# Altium project MD2084-R3M2E2.PrjPcb (part 2 of 3)

## Sheet BOOT_JTAG_AUX.SchDoc: =project_title
size Tabloid; CompanyName: Luxonis Holding; DrawnBy: Martin Debevc; Organization: Luxonis Holding; Address1: 1925 Harmony Park Drive; Address2: Westminster, CO; Address3: 80234; Address4: United States; DocumentNumber: D2088000; Revision: R3M2E2; SheetNumber: 3; SheetTotal: 13
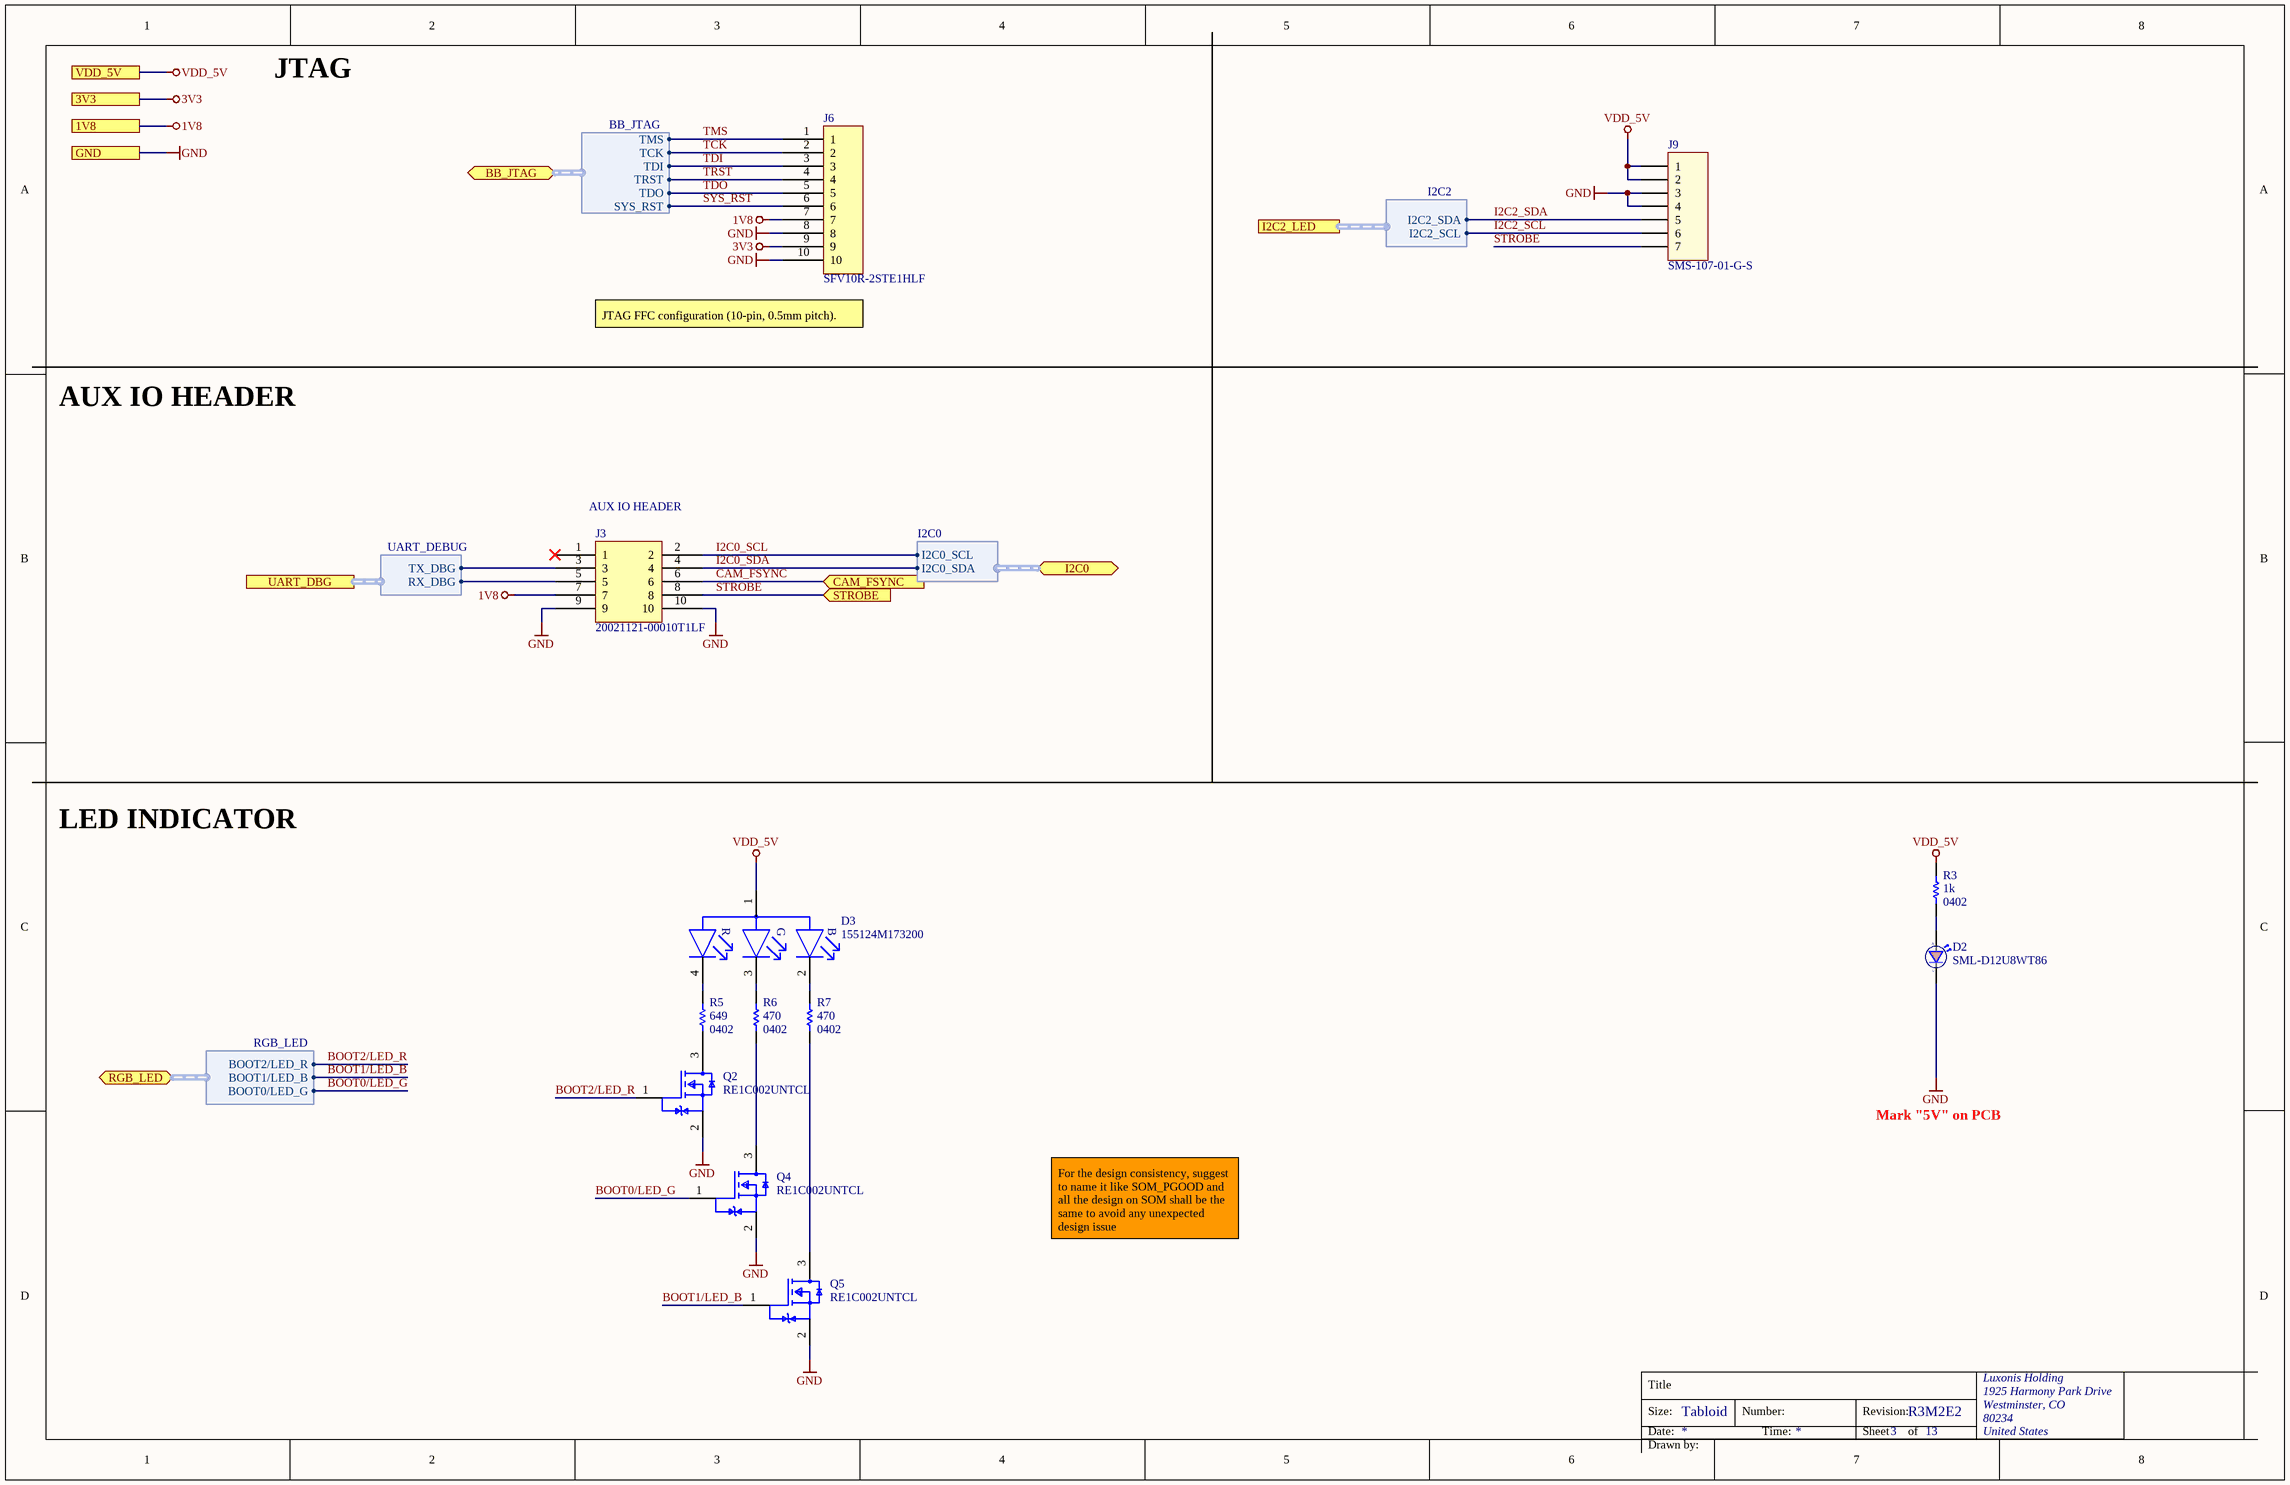
[diagram p7: BOOT_JTAG_AUX.SchDoc]

### Parts
D2  SML-D12U8WT86  [SML_D1xx8W]
D3  155124M173200  [FP-155124M173200-MFG]
J3  20021121-00010T1LF  [20021121-00010T1LF]
J6  SFV10R-2STE1HLF  [SFV10R-2STE1HLF]
J9  SMS-107-01-G-S  [SMS-107-01-G-S]
Q2  RE1C002UNTCL  [RE1C002UNTCL]
Q4  RE1C002UNTCL  [RE1C002UNTCL]
Q5  RE1C002UNTCL  [RE1C002UNTCL]
R3  value 1k  Case/Package: 0402  [RESC0402(1005)_L]  (hidden comment: RC0402FR-071KL)
R5  value 649  Case/Package: 0402  [RESC1005X40X25NL05T10]  (hidden comment: RC0402FR-07649RL)
R6  value 470  Case/Package: 0402  [RESC0402(1005)_L]  (hidden comment: CRCW0402470RFKED)
R7  value 470  Case/Package: 0402  [RESC0402(1005)_L]  (hidden comment: CRCW0402470RFKED)

### Ports
1V8, 3V3, BB_JTAG (bidir, harness BB_JTAG), CAM_FSYNC (in), GND, I2C0 (bidir, harness I2C0), I2C2_LED (harness I2C2), RGB_LED (bidir, harness RGB_LED), STROBE (in), UART_DBG (harness UART_DEBUG), VDD_5V

### Harnesses
BB_JTAG: TMS, TCK, TDI, TRST, TDO, SYS_RST
I2C0: I2C0_SDA, I2C0_SCL
RGB_LED: BOOT2/LED_R, BOOT1/LED_B, BOOT0/LED_G
UART_DEBUG: RX_DBG, TX_DBG
I2C2: I2C2_SDA, I2C2_SCL

### Nets
1V8: J3.7 J6.7 ; port 1V8
3V3: J6.9 ; port 3V3
GND: D2.1(C) J3.9 J3.10 J6.8 J6.10 J9.3 J9.4 Q2.2(Source) Q4.2(Source) Q5.2(Source) ; port GND
VDD_5V: D3.1(COMMON_ANODE) J9.1 J9.2 R3.2 ; port VDD_5V
BOOT0/LED_G: Q4.1(Gate) ; port RGB_LED.BOOT0/LED_G
BOOT1/LED_B: Q5.1(Gate) ; port RGB_LED.BOOT1/LED_B
BOOT2/LED_R: Q2.1(Gate) ; port RGB_LED.BOOT2/LED_R
CAM_FSYNC: J3.6 ; port CAM_FSYNC
I2C0_SCL: J3.2 ; port I2C0.I2C0_SCL
I2C0_SDA: J3.4 ; port I2C0.I2C0_SDA
I2C2_SCL: J9.6 ; port I2C2_LED.I2C2_SCL
I2C2_SDA: J9.5 ; port I2C2_LED.I2C2_SDA
RX_DBG: J3.3 ; port UART_DBG.TX_DBG
STROBE: J3.8 J9.7 ; port STROBE
SYS_RST: J6.6 ; port BB_JTAG.SYS_RST
TCK: J6.2 ; port BB_JTAG.TCK
TDI: J6.3 ; port BB_JTAG.TDI
TDO: J6.5 ; port BB_JTAG.TDO
TMS: J6.1 ; port BB_JTAG.TMS
TRST: J6.4 ; port BB_JTAG.TRST
TX_DBG: J3.5 ; port UART_DBG.RX_DBG
NetD2_2: D2.2(A) R3.1
NetD3_2: D3.2(BLUE_C) R7.2
NetD3_3: D3.3(GREEN_C) R6.2
NetD3_4: D3.4(RED_C) R5.2
NetQ2_3: Q2.3(Drain) R5.1
NetQ4_3: Q4.3(Drain) R6.1
NetQ5_3: Q5.3(Drain) R7.1

Not connected (* = marked no-connect by the designer): J3 1*

### Notes on the sheet
- JTAG
- (near J6) JTAG FFC configuration (10-pin, 0.5mm pitch).
- AUX IO HEADER
- (near J3) AUX IO HEADER
- LED INDICATOR
- Mark "5V" on PCB
- For the design consistency, suggest to name it like SOM_PGOOD and all the design on SOM shall be the same to avoid any unexpected design issue
- Title
- Size:
- Date:
- Tabloid
- Number:
- Time:
- Revision:
- Sheet
- of
- Drawn by:
- (in symbol CMP-007-00038-4) R; G; B

### Library data of the parts
D2 = CMP-111-000005-2: LED RED DIFFUSED 0603 SMD Red 620nm LED Indication - Discrete 2.2V 0603 (1608 Metric); Manufacturer 1: Rohm; Forward Current: 20mA; Manufacturer Part Number 1: SML-D12U8WT86; Case/Package: 0603; Forward Voltage: 2.2V; Min Operating Temperature: -40°C; Color: Red; Max Operating Temperature: 85°C
D3 = CMP-007-00038-4: Triple Color LED; Manufacturer 1: Wurth Elektronik; Max Current Rating: 30mA; Viewing Angle: 120°; Colour: RGB; Forward Current: 20mA; Case/Package: 1204; Manufacturer Part Number 1: 155124M173200
J3 = CMP-005-000031-2: CONN HEADER SMD 10POS 1.27MM; Manufacturer 1: Amphenol FCI; Number of Contacts: 10; Contact Resistance: 30mR; Max Voltage Rating (AC): 125V; Connector Type: Male Pin; Row Spacing: 0.05inch; Manufacturer Part Number 1: 20021121-00010T1LF; Stock 1: 1465; Pricing 1: 1=0.77000, 10=0.71800, 100=0.55040, 500=0.47860, 1000=0.39485, 5000=0.34699, 10000=0.32306 (USD); RoHS: Yes; Mount: Surface Mount; Contact Plating: Gold; Color: Black; Contact Material: Copper Alloy; Housing Color: Black; Housing Material: Thermoplastic; Min Operating Temperature: -40°C; Max Operating Temperature: 85°C; Number of Rows: 2; Termination: Solder; Package Quantity: 93; Packaging: Rail/Tube; Number of Positions: 10; Orientation: Straight; Length: 6.35mm; Pitch: 1.27mm; Contact Mating Length: 0.12inch; Depth: 3.4mm; ComponentLink1URL: https://datasheet.ciiva.com/18659/20021121-18659066.pdf?src-supplier=Digi-Key; ComponentLink1Description: https://datasheet.ciiva.com/18659/20021121-18659066.pdf?src-supplier=Digi-Key; ComponentLink2URL: https://datasheet.ciiva.com/10033/20021121-10033582.pdf?src-supplier=Avnet; ComponentLink2Description: https://datasheet.ciiva.com/10033/20021121-10033582.pdf?src-supplier=Avnet; Design Item ID: 20021121-00010T1LF; Pins: 10; Source: LuxonisMaster.SchLib
J6 = CMP-005-000024-3: CONN FFC TOP 10POS 0.50MM R/A; Manufacturer 1: Amphenol FCI; Pitch: 0.5mm; Voltage Rating: 50V; Gender: Female; Orientation: Right Angle; Max Operating Temperature: 105°C; Min Operating Temperature: -55°C; Mount: Surface Mount; Manufacturer Part Number 1: SFV10R-2STE1HLF; Pins: 10
J9 = CMP-00063-2: Board Connector, 7 Contact(s), 1 Row(s), Female, Straight, 0.05 inch Pitch, Solder Terminal, Black Insulator, Socket; Manufacturer Series: SMS; DIN Conformance: No; Body Length: 0.35inch; Mating Information: MULTIPLE MATING PARTS AVAILABLE; Number Of Connectors: 1; Rated Current (Signal): 1A; Additional Feature: TIGER BUY CONTACT; Reliability: COMMERCIAL; Option: General Purpose; Contact Style: SQ PIN-SKT; Contact Resistance: 10mR; Body Depth: 0.18inch; Insertion Force-Max: 2.224N; Reference Standard: UL; Plating Thickness: 30uin; Contact Pattern: RECTANGULAR; Number of Contacts: 7; Body Breadth: 0.1inch; Withdrawl Force-Min: 1.668N; Contact Gender: Female; Mixed Contacts: No; Manufacturer Part Number 1: SMS-107-01-G-S; Pins: 7; MIL Conformance: No; IEC Conformance: No; System: connector; Contact Finish - Termination: Tin (Sn) - with Nickel (Ni) barrier; Number of Rows Loaded: 1; JESD-609 Code: e3; Body/Shell Style: SOCKET; Terminal Length: 0.115inch; Mounting Technology: Board; Min Operating Temperature: -65°C; RoHS Compliant: Yes; Insulation Color: Black; Termination: Solder; Terminal Pitch: 1.27mm; Insulation Material: Glass; Max Operating Temperature: 125°C; Mating Contact Pitch: 0.05inch; Reach SVHC Compliant: Yes; Connector Type: BOARD CONNECTOR; Number Of PCB Rows: 1; PCB Contact Pattern: RECTANGULAR; Contact Finish - Mating: GOLD (30) OVER NICKEL (50); Contact Material: Bronze; Mounting Style: STRAIGHT; Filter Feature: No
Q2 Q4 Q5 = CMP-120-000001-2: MOSFET N-CH 20V 0.2A EMT3; Manufacturer 1: Rohm; Continuous Drain Current: 200mA; Case/Package: SOT-89; Manufacturer Part Number 1: RE1C002UNTCL; Design Item ID: RE1C002UNTCL; Max Drain to Source Voltage: 20V
R3 = CMP-013-000004-10: RES SMD 1K OHM 1% 1/16W 0402; Manufacturer 1: Yageo; Power Rating: 62.5mW; Voltage Rating: 50V; Min Operating Temperature: -55°C; Design Item ID: RC0402FR-071KL; Tolerance: 1%; Max Operating Temperature: 155°C; Manufacturer Part Number 1: RC0402FR-071KL
R5 = CMP-009-00231-10: RES SMD 649 OHM 1% 1/16W 0402; Manufacturer 1: YAGEO; Voltage Rating: 50V; Manufacturer Part Number 1: RC0402FR-07649RL; Tolerance: 1%
R6 = CMP-013-000029-9: RES SMD 470 OHM 1% 1/16W 0402; Manufacturer 1: Vishay; Voltage Rating: 50V; Power Rating: 63mW; Max Operating Temperature: 155°C; Min Operating Temperature: -55°C; Manufacturer Part Number 1: CRCW0402470RFKED; Tolerance: 1%; Design Item ID: CRCW0402470RFKED
R7 = CMP-013-000029-9: RES SMD 470 OHM 1% 1/16W 0402; Manufacturer 1: Vishay; Power Rating: 63mW; Voltage Rating: 50V; Min Operating Temperature: -55°C; Max Operating Temperature: 155°C; Tolerance: 1%; Manufacturer Part Number 1: CRCW0402470RFKED; Design Item ID: CRCW0402470RFKED

## Sheet POWER_GEN.SchDoc: =project_title
size Tabloid; CompanyName: Luxonis Holding; DrawnBy: Martin Debevc; Organization: Luxonis Holding; Address1: 1925 Harmony Park Drive; Address2: Westminster, CO; Address3: 80234; Address4: United States; DocumentNumber: D2088000; Revision: R3M2E2; SheetNumber: 11; SheetTotal: 13
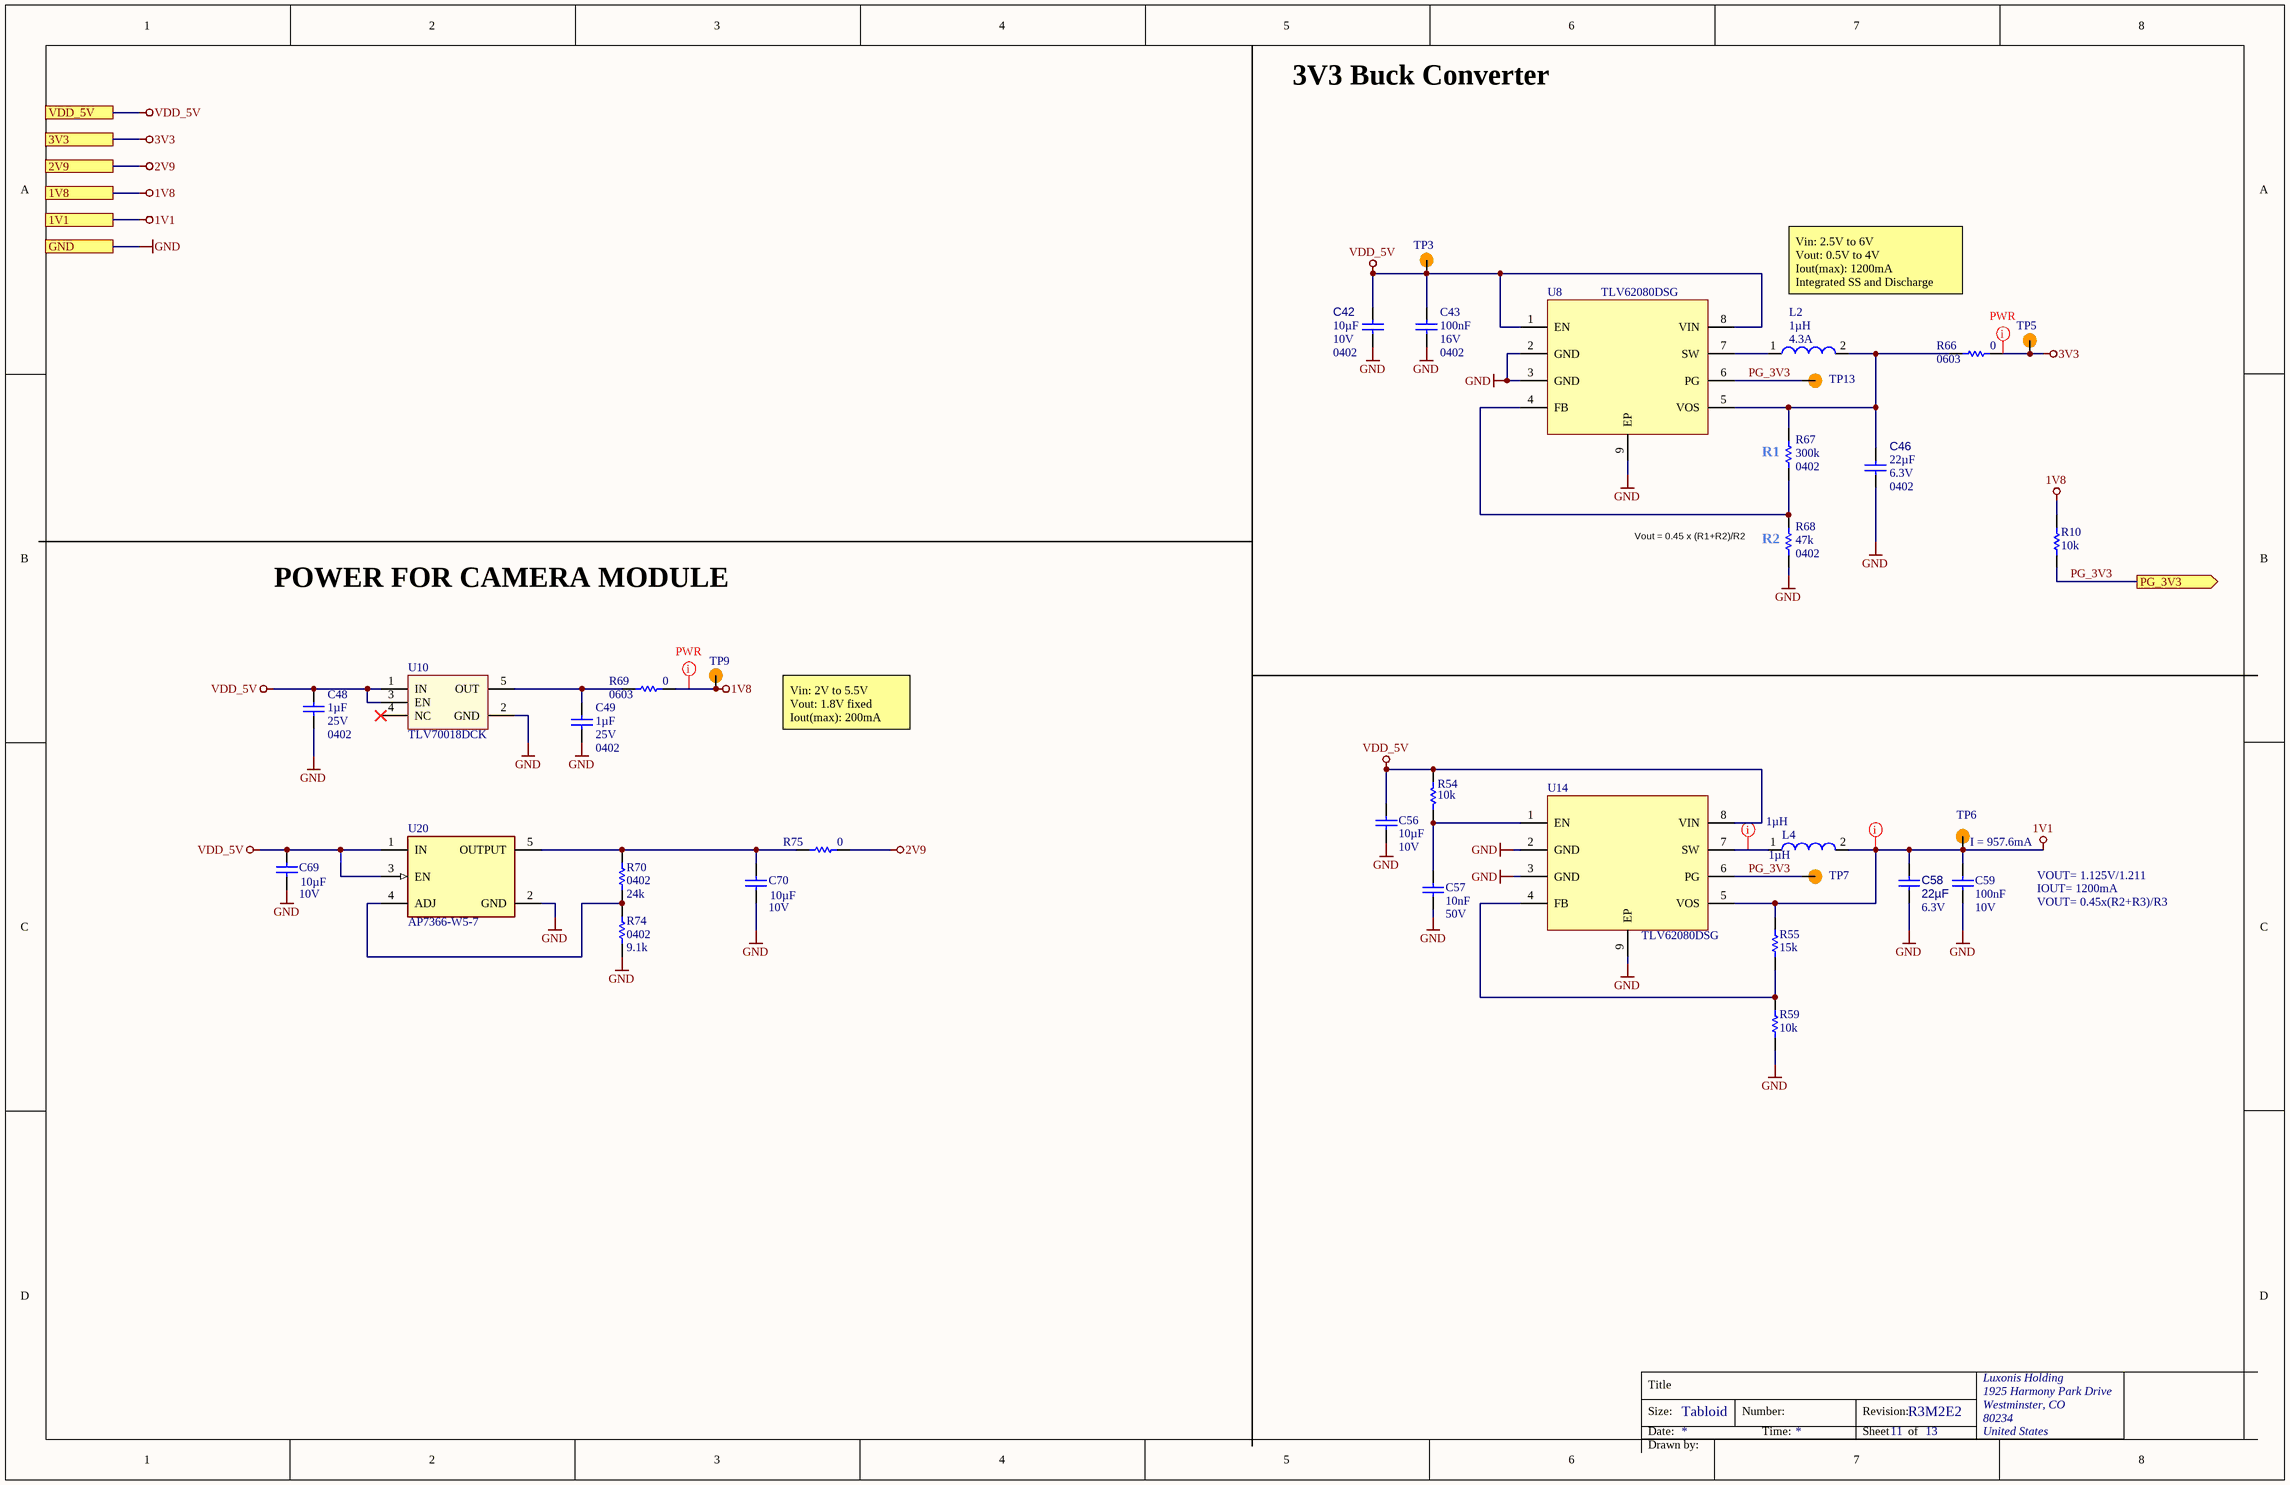
[diagram p8: POWER_GEN.SchDoc]

### Parts
C42  value 10µF  Voltage Rating: 10V  Case/Package: 0402  [CAPC0402(1005)60_L]  (hidden comment: GRM155R61A106ME11D)
C43  value 100nF  Voltage Rating: 16V  Case/Package: 0402  [CAPC0402(1005)60_N]  (hidden comment: CL05B104KO5NFNC)
C46  value 22µF  Voltage Rating: 6.3V  Case/Package: 0402  [CAPC0402(1005)60_L]  (hidden comment: CL05A226MQ5N6J8)
C48  value 1µF  Voltage Rating: 25V  Case/Package: 0402  [CAPC0402(1005)70_N]  (hidden comment: GRM155R61E105KA12D)
C49  value 1µF  Voltage Rating: 25V  Case/Package: 0402  [CAPC0402(1005)70_N]  (hidden comment: GRM155R61E105KA12D)
C56  10µF  Voltage Rating: 10V  [CAPC0603(1608)100_L]
C57  10nF  Voltage Rating: 50V  [CAPC0402(1005)60_L]
C58  22µF  Voltage Rating: 6.3V  [CAPC0402(1005)60_L]
C59  100nF  Voltage Rating: 10V  [CAPC0402(1005)70_L]
C69  value 10µF  Voltage Rating: 10V  [CAPC0603(1608)100_L]  (hidden comment: GRM188R61A106ME69D)
C70  value 10µF  Voltage Rating: 10V  [CAPC0603(1608)100_L]  (hidden comment: GRM188R61A106ME69D)
L2  value 1µH  Current Rating: 4.3A  [DFE252012P-1R0M=P2]  (hidden comment: DFE252012P-1R0M=P2)
L4  1µH  [DFE252012P-1R0M=P2]
R10  10k  [RESC0402(1005)_L]
R54  10k  [RESC0402(1005)_L]
R55  15k  [RESC0402(1005)_L]
R59  10k  [RESC0402(1005)_L]
R66  value 0  Case/Package: 0603  [RESC0603(1608)_N]  (hidden comment: CRCW06030000Z0EA)
R67  value 300k  Case/Package: 0402  [RESC0402(1005)_N]  (hidden comment: RC0402FR-07300KL)
R68  value 47k  Case/Package: 0402  [RESC0402(1005)_L]  (hidden comment: RC0402FR-0747KL)
R69  value 0  Case/Package: 0603  [RESC0603(1608)_N]  (hidden comment: CRCW06030000Z0EA)
R70  value 24k  Case/Package: 0402  [RESC0402(1005)_L]  (hidden comment: RC0402FR-0724KL)
R74  value 9.1k  Case/Package: 0402  [RESC0402(1005)_L]  (hidden comment: CRCW04029K10FKED)
R75  value 0  [RESC0603(1608)_N]  (hidden comment: CRCW06030000Z0EA)
TP3  TEST_POINT  [TP075_150_NS]  (value not drawn)  (no BOM)
TP5  TEST_POINT  [TP075_150_NS]  (value not drawn)  (no BOM)
TP6  TEST_POINT  [TP075_150_NS]  (value not drawn)  (no BOM)
TP7  TEST_POINT  [TP075_150_NS]  (value not drawn)  (no BOM)
TP9  TEST_POINT  [TP075_150_NS]  (value not drawn)  (no BOM)
TP13  TEST_POINT  [TP075_150_NS]  (value not drawn)  (no BOM)
U8  TLV62080DSG  [TLV62080DSG]
U10  TLV70018DCK  [TLV70018DCK]
U14  TLV62080DSG  [TLV62080DSG]
U20  AP7366-W5-7  [FP-SOT25-MFG]

### Ports
1V1, 1V8, 2V9, 3V3, GND, PG_3V3 (out), VDD_5V

### Nets
1V1: C58.2 C59.2 L4.2 R55.2 TP6.1 U14.5(VOS) ; port 1V1
1V8: R10.2 R69.2 TP9.1 ; port 1V8
2V9: R75.2 ; port 2V9
3V3: R66.2 TP5.1 ; port 3V3
GND: C42.1 C43.1 C46.1 C48.1 C49.1 C56.1 C57.1 C58.1 C59.1 C69.1 C70.1 R59.1 R68.1 R74.1 U8.2(GND) U8.3(GND) U8.9(EP) U10.2(GND) U14.2(GND) U14.3(GND) U14.9(EP) U20.2(GND) ; port GND
VDD_5V: C42.2 C43.2 C48.2 C56.2 C69.2 R54.2 TP3.1 U8.1(EN) U8.8(VIN) U10.1(IN) U10.3(EN) U14.8(VIN) U20.1(IN) U20.3(EN) ; port VDD_5V
PG_3V3: R10.1 TP7.1 TP13.1 U8.6(PG) U14.6(PG) ; port PG_3V3
NetC46_2: C46.2 L2.2 R66.1 R67.2 U8.5(VOS)
NetC49_2: C49.2 R69.1 U10.5(OUT)
NetC57_2: C57.2 R54.1 U14.1(EN)
NetC70_2: C70.2 R70.2 R75.1 U20.5(OUTPUT)
NetL2_1: L2.1 U8.7(SW)
NetL4_1: L4.1 U14.7(SW)
NetR55_1: R55.1 R59.2 U14.4(FB)
NetR67_1: R67.1 R68.2 U8.4(FB)
NetR70_1: R70.1 R74.2 U20.4(ADJ)

Not connected (* = marked no-connect by the designer): U10 4(NC)*

### Layout directives
net class PWR; Current Rating: 1200mA: 3V3
net class Power_trace: 1V1, NetL4_1
net class PWR; Current Rating: 300mA: 1V8

### Notes on the sheet
- 3V3 Buck Converter
- Vin: 2.5V to 6V
  Vout: 0.5V to 4V
  Iout(max): 1200mA
  Integrated SS and Discharge
- (near R67) R1
- (near R68) Vout = 0.45 x (R1+R2)/R2
- (near R68) R2
- POWER FOR CAMERA MODULE
- Vin: 2V to 5.5V
  Vout: 1.8V fixed
  Iout(max): 200mA
- (near TP6) I = 957.6mA
- VOUT= 1.125V/1.211
- IOUT= 1200mA
- VOUT= 0.45x(R2+R3)/R3
- Title
- Size:
- Date:
- Tabloid
- Number:
- Time:
- Revision:
- Sheet
- of
- Drawn by:

### Library data of the parts
C42 = CMP-001-00125-4: CAP CER 10UF 10V X5R 0402 20%; Manufacturer 1: Murata; Mounting Technology: SMT; Tolerance: 20%; Manufacturer Part Number 1: GRM155R61A106ME11D; Dielectric: X5R
C43 = CMP-108-000002-6: as C38 on sheet CONNECTOR_A; ComponentLink1URL: https://datasheet.ciiva.com/25767/cl05b104ko5nfnc-25767124.pdf?src-supplier=Digi-Key; Length: 1mm; Design Item ID: CL05B104KO5NFNC; Tolerance: 10%; Min Operating Temperature: -55°C; Width: 0.02inch; Dielectric: X7R; ComponentLink1Description: https://datasheet.ciiva.com/25767/cl05b104ko5nfnc-25767124.pdf?src-supplier=Digi-Key; Height: 0.5mm; Depth: 0.5mm; Manufacturer Part Number 1: CL05B104KO5NFNC; Max Operating Temperature: 125°C; Mounting Technology: SMT
C46 = CMP-001-00163-4: CAP CER 22UF 6.3V X5R 0402 20%; Manufacturer 1: Samsung; Manufacturer Part Number 1: CL05A226MQ5N6J8; Mounting Technology: Surface Mount; Tolerance: 20%
C48 C49 = CMP-108-000014-5: as C17 on sheet ETH_PCIE_CTRL; ComponentLink2Description: https://datasheet.ciiva.com/7719/1666664-7719006.pdf?src-supplier=Element14; ComponentLink2URL: https://datasheet.ciiva.com/7719/1666664-7719006.pdf?src-supplier=Element14; Max Operating Temperature: 85°C; Depth: 0.5mm; Mounting Technology: SMT; ComponentLink1URL: https://datasheet.ciiva.com/22732/1666664-22732122.pdf?src-supplier=Element14; Length: 1mm; ComponentLink1Description: https://datasheet.ciiva.com/22732/1666664-22732122.pdf?src-supplier=Element14; Manufacturer Part Number 1: GRM155R61E105KA12D; Tolerance: 10%; Design Item ID: GRM155R61E105KA12D; Dielectric: X5R; Min Operating Temperature: -55°C; Height: 0.5mm; Width: 0.5mm
C56 = CMP-004-000018-4: CAP CER 10UF 10V X5R 0603 20%; Manufacturer 1: Murata; Manufacturer Part Number 1: GRM188R61A106ME69D; Case/Package: 0603; Min Operating Temperature: -55°C; Max Operating Temperature: 85°C; Tolerance: 20%; Dielectric: X5R; Length: 1.6mm; Height: 0.8mm; Width: 0.8mm; Depth: 0.8mm; ComponentLink1URL: http://www.mouser.com/ds/2/281/c02e-2905.pdf?src-supplier=Mouser; ComponentLink1Description: http://www.mouser.com/ds/2/281/c02e-2905.pdf?src-supplier=Mouser; ComponentLink2URL: http://components.arrow.com/part/dataview/0323_06119472?src-supplier=Arrow+Europe; ComponentLink2Description: http://components.arrow.com/part/dataview/0323_06119472?src-supplier=Arrow+Europe; ComponentLink3URL: http://www.farnell.com/datasheets/2048014.pdf?src-supplier=Farnell; ComponentLink3Description: http://www.farnell.com/datasheets/2048014.pdf?src-supplier=Farnell; ComponentLink4URL: http://www.farnell.com/datasheets/1872210.pdf?src-supplier=Farnell; ComponentLink4Description: http://www.farnell.com/datasheets/1872210.pdf?src-supplier=Farnell; ComponentLink5URL: http://search.murata.co.jp/Ceramy/image/img/A01X/G101/ENG/GRM188R61A106ME69-01.pdf?src-supplier=Digi-Key; ComponentLink5Description: http://search.murata.co.jp/Ceramy/image/img/A01X/G101/ENG/GRM188R61A106ME69-01.pdf?src-supplier=Digi-Key; ComponentLink6URL: http://www.farnell.com/datasheets/1872210.pdf?src-supplier=Newark; ComponentLink6Description: http://www.farnell.com/datasheets/1872210.pdf?src-supplier=Newark; ComponentLink7URL: http://www.farnell.com/datasheets/2048014.pdf?src-supplier=Element14; ComponentLink7Description: http://www.farnell.com/datasheets/2048014.pdf?src-supplier=Element14; ComponentLink8URL: http://www.farnell.com/datasheets/2048014.pdf?src-supplier=Newark; ComponentLink8Description: http://www.farnell.com/datasheets/2048014.pdf?src-supplier=Newark; Design Item ID: GRM188R61A106ME69D; Mounting Technology: SMT; Value: 10µF
C57 = CMP-108-000016-6: CAP CER 10000PF 50V X7R 0402 10%; Manufacturer 1: Murata; Manufacturer Part Number 1: GRM155R71H103KA88D; Case/Package: 0402; Min Operating Temperature: -55°C; Max Operating Temperature: 125°C; Tolerance: 10%; Dielectric: X7R; Length: 1mm; Height: 0.5mm; Width: 0.02inch; Depth: 0.5mm; ComponentLink1URL: https://datasheet.ciiva.com/129/product-129810.pdf?src-supplier=Digi-Key; ComponentLink1Description: https://datasheet.ciiva.com/129/product-129810.pdf?src-supplier=Digi-Key; ComponentLink2URL: https://datasheet.ciiva.com/19476/1856433-19476546.pdf?src-supplier=Jameco; ComponentLink2Description: https://datasheet.ciiva.com/19476/1856433-19476546.pdf?src-supplier=Jameco; ComponentLink3URL: https://datasheet.ciiva.com/11786/0900766b80ef921d-11786340.pdf?src-supplier=RSComponents; ComponentLink3Description: https://datasheet.ciiva.com/11786/0900766b80ef921d-11786340.pdf?src-supplier=RSComponents; ComponentLink4URL: https://datasheet.ciiva.com/18100/getdatasheetpartid-27434-18100660.pdf?src-supplier=Verical; ComponentLink4Description: https://datasheet.ciiva.com/18100/getdatasheetpartid-27434-18100660.pdf?src-supplier=Verical; ComponentLink5URL: https://datasheet.ciiva.com/22698/1747449-22698420.pdf?src-supplier=Element14; ComponentLink5Description: https://datasheet.ciiva.com/22698/1747449-22698420.pdf?src-supplier=Element14; ComponentLink6URL: https://datasheet.ciiva.com/29199/454225-da-01-en-vs-kondensator-0402-29199740.pdf?src-supplier=Conrad; ComponentLink6Description: https://datasheet.ciiva.com/29199/454225-da-01-en-vs-kondensator-0402-29199740.pdf?src-supplier=Conrad; ComponentLink7URL: https://datasheet.ciiva.com/129/grm155r71h103ka88-01-129811.pdf?src-supplier=Digi-Key; ComponentLink7Description: https://datasheet.ciiva.com/129/grm155r71h103ka88-01-129811.pdf?src-supplier=Digi-Key; ComponentLink8URL: https://datasheet.ciiva.com/129/grm155r71h103ka88-01-129812.pdf?src-supplier=Digi-Key; ComponentLink8Description: https://datasheet.ciiva.com/129/grm155r71h103ka88-01-129812.pdf?src-supplier=Digi-Key; ComponentLink9URL: https://datasheet.ciiva.com/16495/product-16495290.pdf?src-supplier=Future+Electronics; ComponentLink9Description: https://datasheet.ciiva.com/16495/product-16495290.pdf?src-supplier=Future+Electronics; ComponentLink10URL: https://datasheet.ciiva.com/5410/product-5410990.pdf?src-supplier=Mouser; ComponentLink10Description: https://datasheet.ciiva.com/5410/product-5410990.pdf?src-supplier=Mouser; Design Item ID: GRM155R71H103KA88D; Mounting Technology: SMT; Value: 10nF
C58 = CMP-001-00163-4: CAP CER 22UF 6.3V X5R 0402 20%; Manufacturer 1: Samsung; Manufacturer Part Number 1: CL05A226MQ5N6J8; Case/Package: 0402; Tolerance: 20%; Mounting Technology: Surface Mount; Value: 22µF
C59 = CMP-108-000015-5: CAP CER 0.1UF 10V X7R 0402 5%; Manufacturer 1: Murata; Manufacturer Part Number 1: GRM155R71A104JA01D; Case/Package: 0402; Min Operating Temperature: -55°C; Max Operating Temperature: 125°C; Tolerance: 5%; Dielectric: X7R; Length: 1mm; Height: 0.5mm; Width: 0.02inch; Depth: 0.5mm; ComponentLink1URL: https://datasheet.ciiva.com/5411/product-5411135.pdf?src-supplier=Mouser; ComponentLink1Description: https://datasheet.ciiva.com/5411/product-5411135.pdf?src-supplier=Mouser; ComponentLink2URL: https://datasheet.ciiva.com/11618/c02e-11618821.pdf?src-supplier=Avnet; ComponentLink2Description: https://datasheet.ciiva.com/11618/c02e-11618821.pdf?src-supplier=Avnet; Design Item ID: GRM155R71A104JA01D; Mounting Technology: SMT; Value: 100nF
C69 C70 = CMP-004-000018-4: CAP CER 10UF 10V X5R 0603 20%; Manufacturer 1: Murata; Manufacturer Part Number 1: GRM188R61A106ME69D; Case/Package: 0603; Min Operating Temperature: -55°C; Max Operating Temperature: 85°C; Tolerance: 20%; Dielectric: X5R; Length: 1.6mm; Height: 0.8mm; Width: 0.8mm; Depth: 0.8mm; ComponentLink1URL: http://www.mouser.com/ds/2/281/c02e-2905.pdf?src-supplier=Mouser; ComponentLink1Description: http://www.mouser.com/ds/2/281/c02e-2905.pdf?src-supplier=Mouser; ComponentLink2URL: http://components.arrow.com/part/dataview/0323_06119472?src-supplier=Arrow+Europe; ComponentLink2Description: http://components.arrow.com/part/dataview/0323_06119472?src-supplier=Arrow+Europe; ComponentLink3URL: http://www.farnell.com/datasheets/2048014.pdf?src-supplier=Farnell; ComponentLink3Description: http://www.farnell.com/datasheets/2048014.pdf?src-supplier=Farnell; ComponentLink4URL: http://www.farnell.com/datasheets/1872210.pdf?src-supplier=Farnell; ComponentLink4Description: http://www.farnell.com/datasheets/1872210.pdf?src-supplier=Farnell; ComponentLink5URL: http://search.murata.co.jp/Ceramy/image/img/A01X/G101/ENG/GRM188R61A106ME69-01.pdf?src-supplier=Digi-Key; ComponentLink5Description: http://search.murata.co.jp/Ceramy/image/img/A01X/G101/ENG/GRM188R61A106ME69-01.pdf?src-supplier=Digi-Key; ComponentLink6URL: http://www.farnell.com/datasheets/1872210.pdf?src-supplier=Newark; ComponentLink6Description: http://www.farnell.com/datasheets/1872210.pdf?src-supplier=Newark; ComponentLink7URL: http://www.farnell.com/datasheets/2048014.pdf?src-supplier=Element14; ComponentLink7Description: http://www.farnell.com/datasheets/2048014.pdf?src-supplier=Element14; ComponentLink8URL: http://www.farnell.com/datasheets/2048014.pdf?src-supplier=Newark; ComponentLink8Description: http://www.farnell.com/datasheets/2048014.pdf?src-supplier=Newark; Design Item ID: GRM188R61A106ME69D; Mounting Technology: SMT
L2 = CMP-082-000001-2: FIXED IND 1UH 3.2A 42 MOHM SMD; Manufacturer: Murata; Tolerance: 20%; Manufacturer Part Number: DFE252012P-1R0M=P2; Case/Package: 1008; Manufacturer 1: Murata; Manufacturer Part Number 1: DFE252012P-1R0M=P2; Manufacturer 2: Murata; Manufacturer Part Number 2: DFE252012P-1R0M=P2; Manufacturer 3: Murata; Manufacturer Part Number 3: DFE252012P-1R0M=P2; Manufacturer 4: Murata; Manufacturer Part Number 4: DFE252012P-1R0M=P2
L4 = CMP-082-000001-2: FIXED IND 1UH 3.2A 42 MOHM SMD; Manufacturer 1: Murata; Current Rating: 4.3A; Tolerance: 20%; Case/Package: 1008; Manufacturer Part Number 1: DFE252012P-1R0M=P2; Manufacturer 2: Murata; Manufacturer Part Number 2: DFE252012P-1R0M=P2; Manufacturer 3: Murata; Manufacturer Part Number 3: DFE252012P-1R0M=P2; Manufacturer 4: Murata; Manufacturer Part Number 4: DFE252012P-1R0M=P2; Manufacturer: Murata; Manufacturer Part Number: DFE252012P-1R0M=P2; Value: 1µH
R10 R54 R59 = CMP-115-000004-8: RES SMD 10K OHM 1% 1/16W 0402; Manufacturer 1: Yageo; Manufacturer Part Number 1: RC0402FR-1310KL; Temperature Coefficient: 100ppm/°C; Power Rating: 62.5mW; Voltage Rating: 50V; Case/Package: 0402; Min Operating Temperature: -55°C; Max Operating Temperature: 155°C; Tolerance: 1%; Design Item ID: RC0402FR-1310KL; Value: 10k
R55 = CMP-013-000009-9: RES SMD 15K OHM 1% 1/16W 0402; Manufacturer 1: Yageo; Manufacturer Part Number 1: RC0402FR-0715KL; Power Rating: 62.5mW; Voltage Rating: 50V; Case/Package: 0402; Min Operating Temperature: -55°C; Max Operating Temperature: 155°C; Tolerance: 1%; Design Item ID: RC0402FR-0715KL; Value: 15k
R66 R69 R75 = CMP-115-000011-7: RES SMD 0 OHM 5% 1/10W 0603; Manufacturer 1: Vishay; Manufacturer Part Number 1: CRCW0603-0000Z0EA; Temperature Coefficient: 100ppm/°C; Power Rating: 100mW; Voltage Rating: 75V; Tolerance: 5%; Design Item ID: CRCW06030000Z0EA; Max Operating Temperature: 155°C; Min Operating Temperature: -55°C
  R75: Case/Package: 0603
R67 = CMP-013-000049-8: RES SMD 300K OHM 1% 1/16W 0402; Manufacturer 1: Yageo; Voltage Rating: 50V; Power Rating: 63mW; Tolerance: 1%; Design Item ID: RC0402FR-07300KL; Max Operating Temperature: 155°C; Manufacturer Part Number 1: RC0402FR-07300KL; Min Operating Temperature: -55°C
R68 = CMP-013-000015-9: RES SMD 47K OHM 1% 1/16W 0402; Manufacturer 1: Yageo; Power Rating: 62.5mW; Voltage Rating: 50V; Max Operating Temperature: 155°C; Tolerance: 1%; Min Operating Temperature: -55°C; Manufacturer Part Number 1: RC0402FR-0747KL; Design Item ID: RC0402FR-0747KL
R70 = CMP-009-00213-16: RES SMD 24K OHM 1% 1/16W 0402; Manufacturer 1: YAGEO; Power Rating: 62.5mW; Manufacturer Part Number 1: RC0402FR-0724KL; Tolerance: 1%
R74 = CMP-00048-2: RES SMD 9.1K OHM 1% 1/16W 0402; Manufacturer 1: Vishay; Temperature Coefficient: 100ppm/°C; Package Width: 0.5mm; Power: 63mW; Package Length: 1mm; Reference Standard: AEC-Q200; Package Height: 0.35mm; Rated Temperature: 70°C; Working Voltage: 50V; Resistor Type: FIXED RESISTOR; Min Operating Temperature: -55°C; Reach SVHC Compliant: Yes; Max Operating Temperature: 155°C; Package Style: SMTMeter; Packaging: Tape and Reel; JESD-609 Code: e3; Mounting Technology: Surface Mount; Terminal Finish: Nickel; Construction: Chip; Manufacturer Part Number 1: CRCW04029K10FKED; Tolerance: 1%; Package Shape: Rectangular; Technology: METAL GLAZE/THICK FILM; Pins: 2; RoHS Compliant: Yes; Termination: Wraparound
TP3 TP5-TP7 TP9 TP13 = CMP-015-000000-5: Manufacturer Part Number 1: /; Design Item ID: TEST_POINT; Source: LuxonisMaster.SchLib
U8 = CMP-010-000007-4: IC REG BUCK ADJ 1.2A SYNC 8WSON; Manufacturer Part Number 1: TLV62080DSGR; Manufacturer 1: Texas Instruments; Output Voltage: 4V; Min Output Voltage: 500mV; Max Supply Voltage: 5.5V; Min Supply Voltage: 2.5V; Vfb/Vout: 450mV; Max Input Voltage: 6V; Max Output Current: 1.2A; Max Operating Temperature: 125°C; Max Output Voltage: 4V; Min Operating Temperature: -40°C; Min Input Voltage: 2.5V
U10 = CMP-113-000003-2: IC REG LINEAR 1.8V 200MA SC70-5 Linear Voltage Regulator IC  1 Output  200mA SC-70-5; Manufacturer 1: Texas Instruments; Manufacturer Part Number 1: TLV70018DCKR; Max Supply Voltage: 5.5V; Min Supply Voltage: 2V; Min Operating Temperature: -40°C; Pins: 5; Max Output Voltage: 1.8V; Max Operating Temperature: 125°C; Case/Package: SC; Max Output Current: 200mA; Min Output Voltage: 1.8V
U14 = CMP-010-000007-4: IC REG BUCK ADJ 1.2A SYNC 8WSON; Manufacturer 1: Texas Instruments; Manufacturer Part Number 1: TLV62080DSGR; Output Voltage: 4V; Min Supply Voltage: 2.5V; Min Output Voltage: 500mV; Max Supply Voltage: 5.5V; Vfb/Vout: 450mV; Max Input Voltage: 6V; Min Operating Temperature: -40°C; Max Operating Temperature: 125°C; Max Output Current: 1.2A; Max Output Voltage: 4V; Min Input Voltage: 2.5V
U20 = CMP-019-00055-5: Adjustable Positive LDO Regulator, 0.8V Min, 5V Max, PDSO5; Manufacturer 1: Diodes; Output Voltage: 800mV; Min Supply Voltage: 2.2V; Output Current: 600mA; Max Supply Voltage: 6V; Manufacturer part number 1: AP7366-W5-7; Pins: 5; Max Input Voltage: 6V; Vfb/Vout: 800mV; Max Output Current: 600mA; Min Input Voltage: 2.2V

## Sheet Thermal_CCM.SchDoc: =project_title
size Tabloid; PageSetup: Record=PageOptions|CenterHorizontal=True|CenterVertical=True|PrintScale=0.71|XCorrection=1.00|YCorrection=1.00|PrintKind=0|BorderSize=5000000|LeftOffset=0|BottomOffset=0|Orientation=2|PaperLength=1000|PaperWidth=1000|Scale=100|PaperSource=7|PrintQuality=-4|MediaType=1|DitherType=10|PrintScaleMode=1|PaperKind=A4; CompanyName: Luxonis Holding; DrawnBy: Martin Debevc; Organization: Luxonis Holding; Address1: 1925 Harmony Park Drive; Address2: Westminster, CO; Address3: 80234; Address4: United States; DocumentNumber: D2088000; Revision: R3M2E2; SheetNumber: 13; SheetTotal: 13
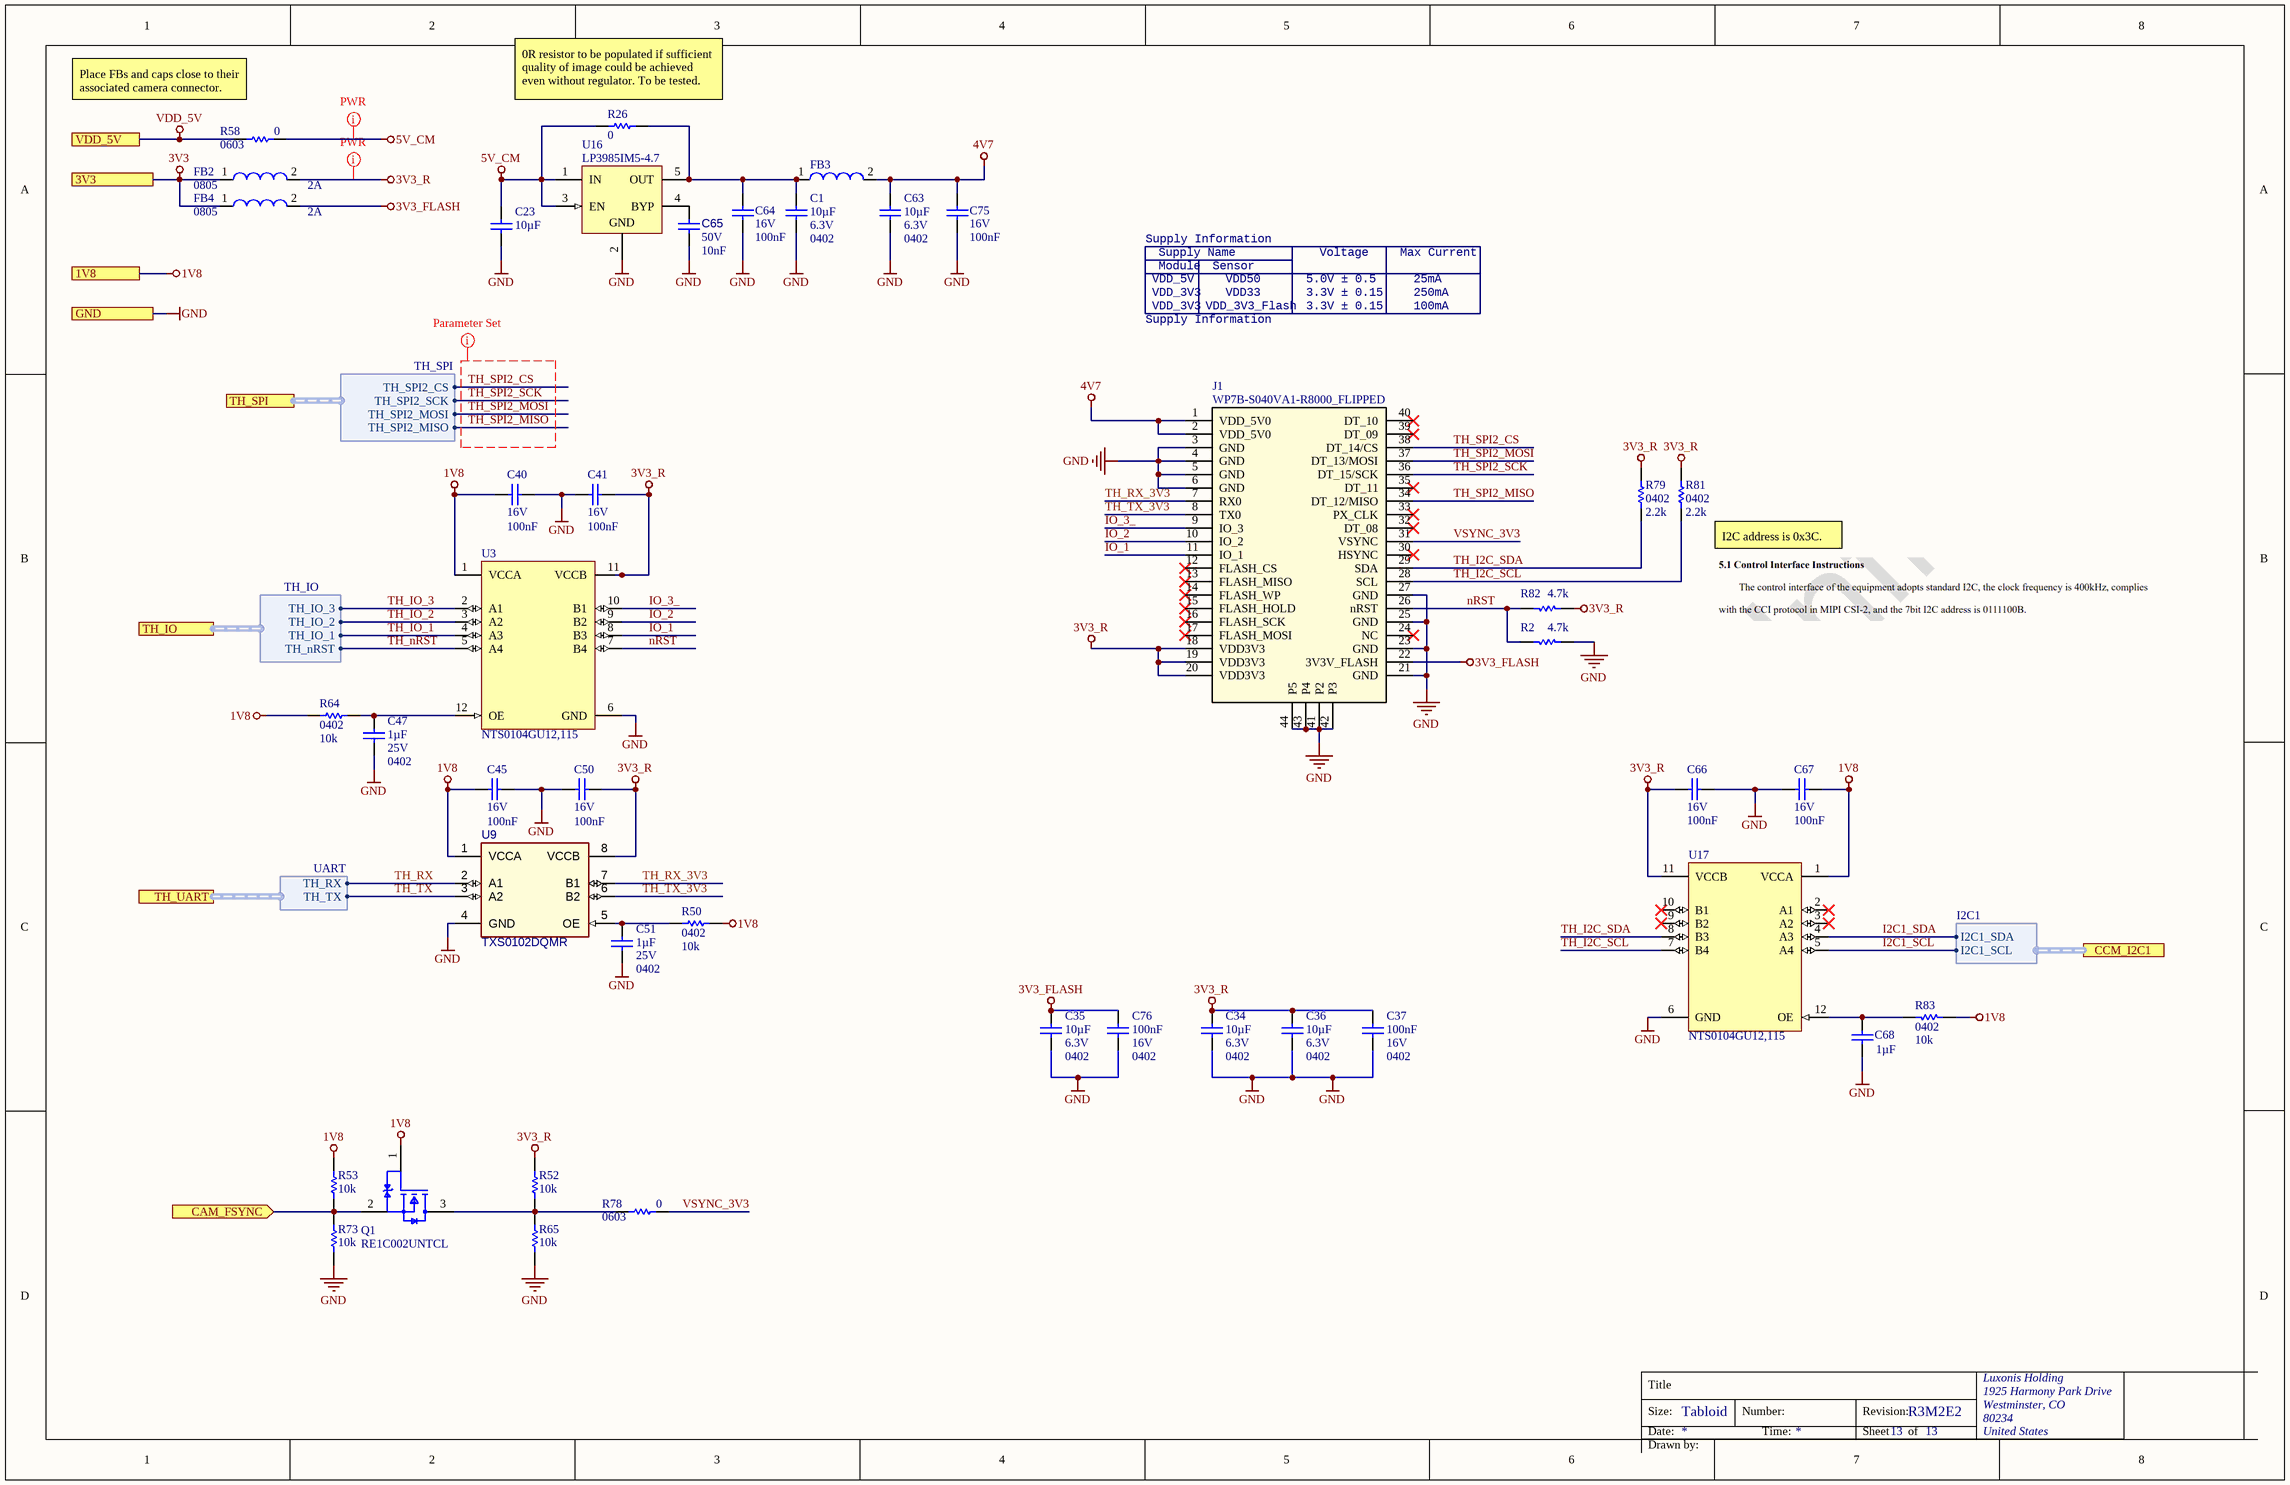
[diagram p9: Thermal_CCM.SchDoc]

### Parts
C1  value 10µF  Voltage Rating: 6.3V  Case/Package: 0402  [CAPC0402(1005)70_N]  (hidden comment: GRM155R60J106ME15D)
C23  value 10µF  [CAPC0402(1005)70_L]  (hidden comment: GRM155R60J106ME15D)
C34  value 10µF  Voltage Rating: 6.3V  Case/Package: 0402  [CAPC0402(1005)70_L]  (hidden comment: GRM155R60J106ME15D)
C35  value 10µF  Voltage Rating: 6.3V  Case/Package: 0402  [CAPC0402(1005)70_L]  (hidden comment: GRM155R60J106ME15D)
C36  value 10µF  Voltage Rating: 6.3V  Case/Package: 0402  [CAPC0402(1005)70_L]  (hidden comment: GRM155R60J106ME15D)
C37  value 100nF  Voltage Rating: 16V  Case/Package: 0402  [CAPC0402(1005)60_L]  (hidden comment: CL05B104KO5NFNC)
C40  value 100nF  Voltage Rating: 16V  [CAPC0402(1005)60_L]  (hidden comment: CL05B104KO5NFNC)
C41  value 100nF  Voltage Rating: 16V  [CAPC0402(1005)60_L]  (hidden comment: CL05B104KO5NFNC)
C45  value 100nF  Voltage Rating: 16V  [CAPC0402(1005)60_L]  (hidden comment: CL05B104KO5NFNC)
C47  value 1µF  Voltage Rating: 25V  Case/Package: 0402  [CAPC0402(1005)70_L]  (hidden comment: GRM155R61E105KA12D)
C50  value 100nF  Voltage Rating: 16V  [CAPC0402(1005)60_L]  (hidden comment: CL05B104KO5NFNC)
C51  value 1µF  Voltage Rating: 25V  Case/Package: 0402  [CAPC0402(1005)70_L]  (hidden comment: GRM155R61E105KA12D)
C63  value 10µF  Voltage Rating: 6.3V  Case/Package: 0402  [CAPC0402(1005)70_N]  (hidden comment: GRM155R60J106ME15D)
C64  value 100nF  Voltage Rating: 16V  [CAPC0402(1005)60_N]  (hidden comment: CL05B104KO5NFNC)
C65  value 10nF  Voltage Rating: 50V  [CAPC0402(1005)60_L]  (hidden comment: C0402C103K5RACTU)
C66  value 100nF  Voltage Rating: 16V  [CAPC0402(1005)60_L]  (hidden comment: CL05B104KO5NFNC)
C67  value 100nF  Voltage Rating: 16V  [CAPC0402(1005)60_L]  (hidden comment: CL05B104KO5NFNC)
C68  value 1µF  [CAPC0402(1005)70_L]  (hidden comment: GRM155R61E105KA12D)
C75  value 100nF  Voltage Rating: 16V  [CAPC0402(1005)60_N]  (hidden comment: CL05B104KO5NFNC)
C76  value 100nF  Voltage Rating: 16V  Case/Package: 0402  [CAPC0402(1005)60_L]  (hidden comment: CL05B104KO5NFNC)
FB2  Current Rating: 2A  Case/Package: 0805  [2508056017Y2]  (hidden comment: 2508056017Y2)
FB3  2508056017Y2  [2508056017Y2]  (value not drawn)
FB4  Current Rating: 2A  Case/Package: 0805  [2508056017Y2]  (hidden comment: 2508056017Y2)
J1  WP7B-S040VA1-R8000_FLIPPED  [WP7B-S040VA1-R8000-Edge mount]
Q1  RE1C002UNTCL  [RE1C002UNTCL]
R2  value 4.7k  [RESC0402(1005)_L]  (hidden comment: RC0402FR-074K7L)
R26  value 0  [RESC0603(1608)_N]  (hidden comment: CRCW06030000Z0EA)
R50  value 10k  Case/Package: 0402  [RESC0402(1005)_L]  (hidden comment: RC0402FR-1310KL)
R52  value 10k  [RESC0402(1005)_L]  (hidden comment: RC0402FR-1310KL)
R53  value 10k  [RESC0402(1005)_L]  (hidden comment: RC0402FR-1310KL)
R58  value 0  Case/Package: 0603  [RESC0603(1608)_N]  (hidden comment: CRCW06030000Z0EA)
R64  value 10k  Case/Package: 0402  [RESC0402(1005)_L]  (hidden comment: RC0402FR-1310KL)
R65  value 10k  [RESC0402(1005)_L]  (hidden comment: RC0402FR-1310KL)
R73  value 10k  [RESC0402(1005)_L]  (hidden comment: RC0402FR-1310KL)
R78  value 0  Case/Package: 0603  [RESC0603(1608)_N]  (hidden comment: CRCW06030000Z0EA)
R79  value 2.2k  Case/Package: 0402  [RESC0402(1005)_L]  (hidden comment: RC0402FR-072K2L)
R81  value 2.2k  Case/Package: 0402  [RESC0402(1005)_L]  (hidden comment: RC0402FR-072K2L)
R82  value 4.7k  [RESC0402(1005)_L]  (hidden comment: RC0402FR-074K7L)
R83  value 10k  Case/Package: 0402  [RESC0402(1005)_L]  (hidden comment: RC0402FR-1310KL)
U3  NTS0104GU12,115  [QFN40P170X200X50-12N]
U9  TXS0102DQMR  [DQM]
U16  LP3985IM5-4.7  [DBV0005A_L]
U17  NTS0104GU12,115  [QFN40P170X200X50-12N]

### Ports
1V8, 3V3, CAM_FSYNC (in), CCM_I2C1 (harness I2C1), GND, TH_IO (harness TH_IO), TH_SPI (harness TH_SPI), TH_UART (harness UART), VDD_5V

### Harnesses
UART: TH_RX, TH_TX
I2C1: I2C1_SDA, I2C1_SCL
TH_IO: TH_IO_3, TH_IO_2, TH_IO_1, TH_nRST
TH_SPI: TH_SPI2_CS, TH_SPI2_SCK, TH_SPI2_MOSI, TH_SPI2_MISO

### Nets
1V8: C40.2 C45.2 C67.2 Q1.1(Gate) R50.2 R53.2 R64.2 R83.2 U3.1(VCCA) U9.1(VCCA) U17.1(VCCA) ; port 1V8
3V3: FB2.1 FB4.1 ; port 3V3
3V3_FLASH: C35.2 C76.2 FB4.2 J1.22(3V3V_FLASH)
3V3_R: C34.2 C36.2 C37.2 C41.1 C50.1 C66.1 FB2.2 J1.18(VDD3V3) J1.19(VDD3V3) J1.20(VDD3V3) R52.2 R79.2 R81.2 R82.2 U3.11(VCCB) U9.8(VCCB) U17.11(VCCB)
4V7: C63.2 C75.1 FB3.2 J1.1(VDD_5V0) J1.2(VDD_5V0)
5V_CM: C23.2 R26.1 R58.2 U16.1(IN) U16.3(EN)
GND: C1.1 C23.1 C34.1 C35.1 C36.1 C37.1 C40.1 C41.2 C45.1 C47.1 C50.2 C51.1 C63.1 C64.2 C65.1 C66.2 C67.1 C68.1 C75.2 C76.1 J1.3(GND) J1.4(GND) J1.5(GND) J1.6(GND) J1.21(GND) J1.23(GND) J1.25(GND) J1.27(GND) J1.41(P2) J1.42(P3) J1.43(P4) J1.44(P5) R2.2 R65.1 R73.1 U3.6(GND) U9.4(GND) U16.2(GND) U17.6(GND) ; port GND
VDD_5V: R58.1 ; port VDD_5V
CAM_FSYNC: Q1.2(Source) R53.1 R73.2 ; port CAM_FSYNC
I2C1_SCL: U17.5(A4) ; port CCM_I2C1.I2C1_SCL
I2C1_SDA: U17.4(A3) ; port CCM_I2C1.I2C1_SDA
IO_1: J1.11(IO_1) U3.8(B3)
IO_2: J1.10(IO_2) U3.9(B2)
IO_3_: J1.9(IO_3) U3.10(B1)
nRST: J1.26(nRST) R2.1 R82.1 U3.7(B4)
TH_I2C_SCL: J1.28(SCL) R81.1 U17.7(B4)
TH_I2C_SDA: J1.29(SDA) R79.1 U17.8(B3)
TH_IO_1: U3.4(A3) ; port TH_IO.TH_IO_1
TH_IO_2: U3.3(A2) ; port TH_IO.TH_IO_2
TH_IO_3: U3.2(A1) ; port TH_IO.TH_IO_3
TH_nRST: U3.5(A4) ; port TH_IO.TH_nRST
TH_RX: U9.2(A1) ; port TH_UART.TH_RX
TH_RX_3V3: J1.7(RX0) U9.7(B1)
TH_SPI2_CS: J1.38(DT_14/CS) ; port TH_SPI.TH_SPI2_CS
TH_SPI2_MISO: J1.34(DT_12/MISO) ; port TH_SPI.TH_SPI2_MISO
TH_SPI2_MOSI: J1.37(DT_13/MOSI) ; port TH_SPI.TH_SPI2_MOSI
TH_SPI2_SCK: J1.36(DT_15/SCK) ; port TH_SPI.TH_SPI2_SCK
TH_TX: U9.3(A2) ; port TH_UART.TH_TX
TH_TX_3V3: J1.8(TX0) U9.6(B2)
VSYNC_3V3: J1.31(VSYNC) R78.2
NetC1_2: C1.2 C64.1 FB3.1 R26.2 U16.5(OUT)
NetC47_2: C47.2 R64.1 U3.12(OE)
NetC51_2: C51.2 R50.1 U9.5(OE)
NetC65_2: C65.2 U16.4(BYP)
NetC68_2: C68.2 R83.1 U17.12(OE)
NetQ1_3: Q1.3(Drain) R52.1 R65.2 R78.1

Not connected (* = marked no-connect by the designer): J1 12(FLASH_CS)* 13(FLASH_MISO)* 14(FLASH_WP)* 15(FLASH_HOLD)* 16(FLASH_SCK)* 17(FLASH_MOSI)* 24(NC)* 30(HSYNC)* 32(DT_08)* 33(PX_CLK)* 35(DT_11)* 39(DT_09)* 40(DT_10)*; U17 2(A1)* 3(A2)* 9(B2)* 10(B1)*

### Layout directives
net class PWR; Current Rating: 200mA: 3V3_R, 5V_CM
net class TH_SPI: TH_SPI2_CS, TH_SPI2_MISO, TH_SPI2_MOSI, TH_SPI2_SCK

### Notes on the sheet
- (near R58) Place FBs and caps close to their associated camera connector.
- (near R26) 0R resistor to be populated if sufficient quality of image could be achieved even without regulator. To be tested.
- Supply Information
- VDD_5V
- VDD_3V3
- Supply Name
- Module
- Sensor
- VDD50
- VDD33
- 5.0V ± 0.5
- 3.3V ± 0.15
- Voltage
- Max Current
- 25mA
- 250mA
- VDD_3V3_Flash
- 100mA
- (near R81) I2C address is 0x3C.
- Title
- Size:
- Date:
- Tabloid
- Number:
- Time:
- Revision:
- Sheet
- of
- Drawn by:

### Library data of the parts
C1 C23 C34-C36 C63 = CMP-004-000009-5: CAP CER 10UF 6.3V X5R 0402 20%; Manufacturer 1: Murata; Dielectric: X5R; Manufacturer Part Number 1: GRM155R60J106ME15D; ComponentLink1URL: https://www.murata.com/~/media/webrenewal/support/library/catalog/products/capacitor/mlcc/c02e.ashx?la=en-us&src-supplier=Digi-Key; Design Item ID: GRM155R60J106ME15D; Tolerance: 20%; Width: 0.02inch; Length: 0.039inch; Mounting Technology: SMT; Min Operating Temperature: -55°C; Max Operating Temperature: 85°C; ComponentLink1Description: https://www.murata.com/~/media/webrenewal/support/library/catalog/products/capacitor/mlcc/c02e.ashx?la=en-us&src-supplier=Digi-Key
  C23: Voltage Rating: 6.3V; Case/Package: 0402
C37 C40 C41 C45 C50 C64 C66 C67 C75 C76 = CMP-108-000002-6: CAP CER 0.1UF 16V X7R 0402 10%; Manufacturer 1: Samsung; ComponentLink1URL: https://datasheet.ciiva.com/25767/cl05b104ko5nfnc-25767124.pdf?src-supplier=Digi-Key; Length: 1mm; Design Item ID: CL05B104KO5NFNC; Tolerance: 10%; Min Operating Temperature: -55°C; Width: 0.02inch; Dielectric: X7R; ComponentLink1Description: https://datasheet.ciiva.com/25767/cl05b104ko5nfnc-25767124.pdf?src-supplier=Digi-Key; Height: 0.5mm; Depth: 0.5mm; Manufacturer Part Number 1: CL05B104KO5NFNC; Max Operating Temperature: 125°C; Mounting Technology: SMT
  C40 C41 C45 C50 C64 C66 C67 C75: Case/Package: 0402
C47 C51 C68 = CMP-108-000014-5: CAP CER 1UF 25V X5R 0402 10%; Manufacturer 1: Murata; ComponentLink2Description: https://datasheet.ciiva.com/7719/1666664-7719006.pdf?src-supplier=Element14; ComponentLink2URL: https://datasheet.ciiva.com/7719/1666664-7719006.pdf?src-supplier=Element14; Max Operating Temperature: 85°C; Depth: 0.5mm; Mounting Technology: SMT; ComponentLink1URL: https://datasheet.ciiva.com/22732/1666664-22732122.pdf?src-supplier=Element14; Length: 1mm; ComponentLink1Description: https://datasheet.ciiva.com/22732/1666664-22732122.pdf?src-supplier=Element14; Manufacturer Part Number 1: GRM155R61E105KA12D; Tolerance: 10%; Design Item ID: GRM155R61E105KA12D; Dielectric: X5R; Min Operating Temperature: -55°C; Height: 0.5mm; Width: 0.5mm
  C68: Voltage Rating: 25V; Case/Package: 0402
C65 = CMP-001-00069-12: CAP CER 10nF 50V X7R 0402 5%; Manufacturer 1: Kemet; Capacitor Type: Ceramic; Mounting Technology: SMT; Dielectric: X7R; Min Operating Temperature: -55°C; Tolerance: 5%; Manufacturer Part Number 1: C0402C103K5RACTU; Supplier 1: Digikey; Case/Package: 0402; Supplier Part Number 1: 399-C0402C103K5RAC7867TR-ND; Max Operating Temperature: 85°C
FB2-FB4 = CMP-082-000000-2: FERRITE BEAD, 0.1OHM, 2A, 0805, 600R/100MHz; Manufacturer 1: Fair-Rite; Tolerance: 25%; Manufacturer Part Number 1: 2508056017Y2
  FB3: Case/Package: 0805; Current Rating: 2A
J1 = CMP-002-00200-4: 40 pin connector used for thermal Tiny1C, Female, flipped, to be used with FPC connector where flipping is needed.; Manufacturer 1: JAE; Max Current Rating: 300mA; Voltage Rating: 50V; Gender: Receptacle; Min Operating Temperature: -40°C; Max Operating Temperature: 85°C; Connector Type: Female; System: connector; Mounting Technology: SMT; Manufacturer Part Number 1: WP7B-S040VA1-R8000; Pins: 40
Q1 = CMP-120-000001-2: MOSFET N-CH 20V 0.2A EMT3; Manufacturer 1: Rohm; Continuous Drain Current: 200mA; Case/Package: SOT-89; Manufacturer Part Number 1: RE1C002UNTCL; Design Item ID: RE1C002UNTCL; Max Drain to Source Voltage: 20V
R2 R82 = CMP-013-000016-9: RES SMD 4.7K OHM 1% 1/16W 0402; Manufacturer 1: Yageo; Power Rating: 62.5mW; Voltage Rating: 50V; Case/Package: 0402; Min Operating Temperature: -55°C; Manufacturer Part Number 1: RC0402FR-074K7L; Tolerance: 1%; Design Item ID: RC0402FR-074K7L; Max Operating Temperature: 155°C
R26 = CMP-115-000011-7: RES SMD 0 OHM 5% 1/10W 0603; Manufacturer 1: Vishay; Manufacturer Part Number 1: CRCW0603-0000Z0EA; Voltage Rating: 75V; Temperature Coefficient: 100ppm/°C; Power Rating: 100mW; Case/Package: 0603; Design Item ID: CRCW06030000Z0EA; Max Operating Temperature: 155°C; Min Operating Temperature: -55°C; Tolerance: 5%
R50 R52 R53 R64 R65 R73 R83 = CMP-115-000004-8: RES SMD 10K OHM 1% 1/16W 0402; Manufacturer 1: Yageo; Power Rating: 62.5mW; Temperature Coefficient: 100ppm/°C; Voltage Rating: 50V; Min Operating Temperature: -55°C; Max Operating Temperature: 155°C; Design Item ID: RC0402FR-1310KL; Tolerance: 1%; Manufacturer Part Number 1: RC0402FR-1310KL
  R52 R53 R65 R73: Case/Package: 0402
R58 R78 = CMP-115-000011-7: RES SMD 0 OHM 5% 1/10W 0603; Manufacturer 1: Vishay; Manufacturer Part Number 1: CRCW0603-0000Z0EA; Temperature Coefficient: 100ppm/°C; Power Rating: 100mW; Voltage Rating: 75V; Tolerance: 5%; Design Item ID: CRCW06030000Z0EA; Max Operating Temperature: 155°C; Min Operating Temperature: -55°C
R79 R81 = CMP-013-000013-8: RES SMD 2.2K OHM 1% 1/16W 0402; Manufacturer 1: Yageo; Voltage Rating: 50V; Power Rating: 63mW; Tolerance: 1%; Max Operating Temperature: 155°C; Manufacturer Part Number 1: RC0402FR-072K2L; Min Operating Temperature: -55°C; Design Item ID: RC0402FR-072K2L
U3 U17 = CMP-163-000000-6: Voltage Level Translator Bidirectional 1 Circuit 4 Channel 50Mbps 12-XQFN _2x1.7_; Manufacturer 1: NXP USA; Manufacturer Part Number 1: NTS0104GU12,115
U9 = CMP-015-00002-5: IC TRANSLATOR VOLTAGE 8-X2SON; Manufacturer 1: Texas Instruments; Pins: 8; Manufacturer Part Number 1: TXS0102DQMR
U16 = CMP-00024-8: LDO Regulator Pos 4.7V 0.15A 5-Pin SOT-23 T/R; Manufacturer 1: Texas Instruments; Manufacturer Part Number 1: LP3985IM5-4.7/NOPB; Min Input Voltage: 2.5V; Accuracy: 2%; Output Configuration: Positive; Max Supply Current: 250uA; Quiescent Current: 150uA; Number of Outputs: 1; Output Current: 150mA; Min Current Limit: 300mA; Max Power Dissipation: 250mW; Output Type: Fixed; Power Supply Rejection Ratio (PSRR): 40dB; Current Rating: 150A; Max Supply Voltage: 6V; Dropout Voltage: 60mV; Vfb/Vout: 1V; Packaging: Tape and Reel; Min Operating Temperature: -40°C; Min Output Voltage: 4.7V; Lead Free: Contains Lead; Radiation Hardening: No; Polarity: Positive; Mounting Technology: Surface Mount; Number of Regulators: 1; Pins: 5; Max Operating Temperature: 125°C; Series: -; Max Output current: 150mA; Package Quantity: 1000; RoHS Compliant: No; Output Voltage: 4.7V; Case/Package: SOT-23-5; Max Input Voltage: 6V